# EAGLE schematic Sequencer Block Diagram (EAGLE 9.2.2)

## Sheet 1 of 6
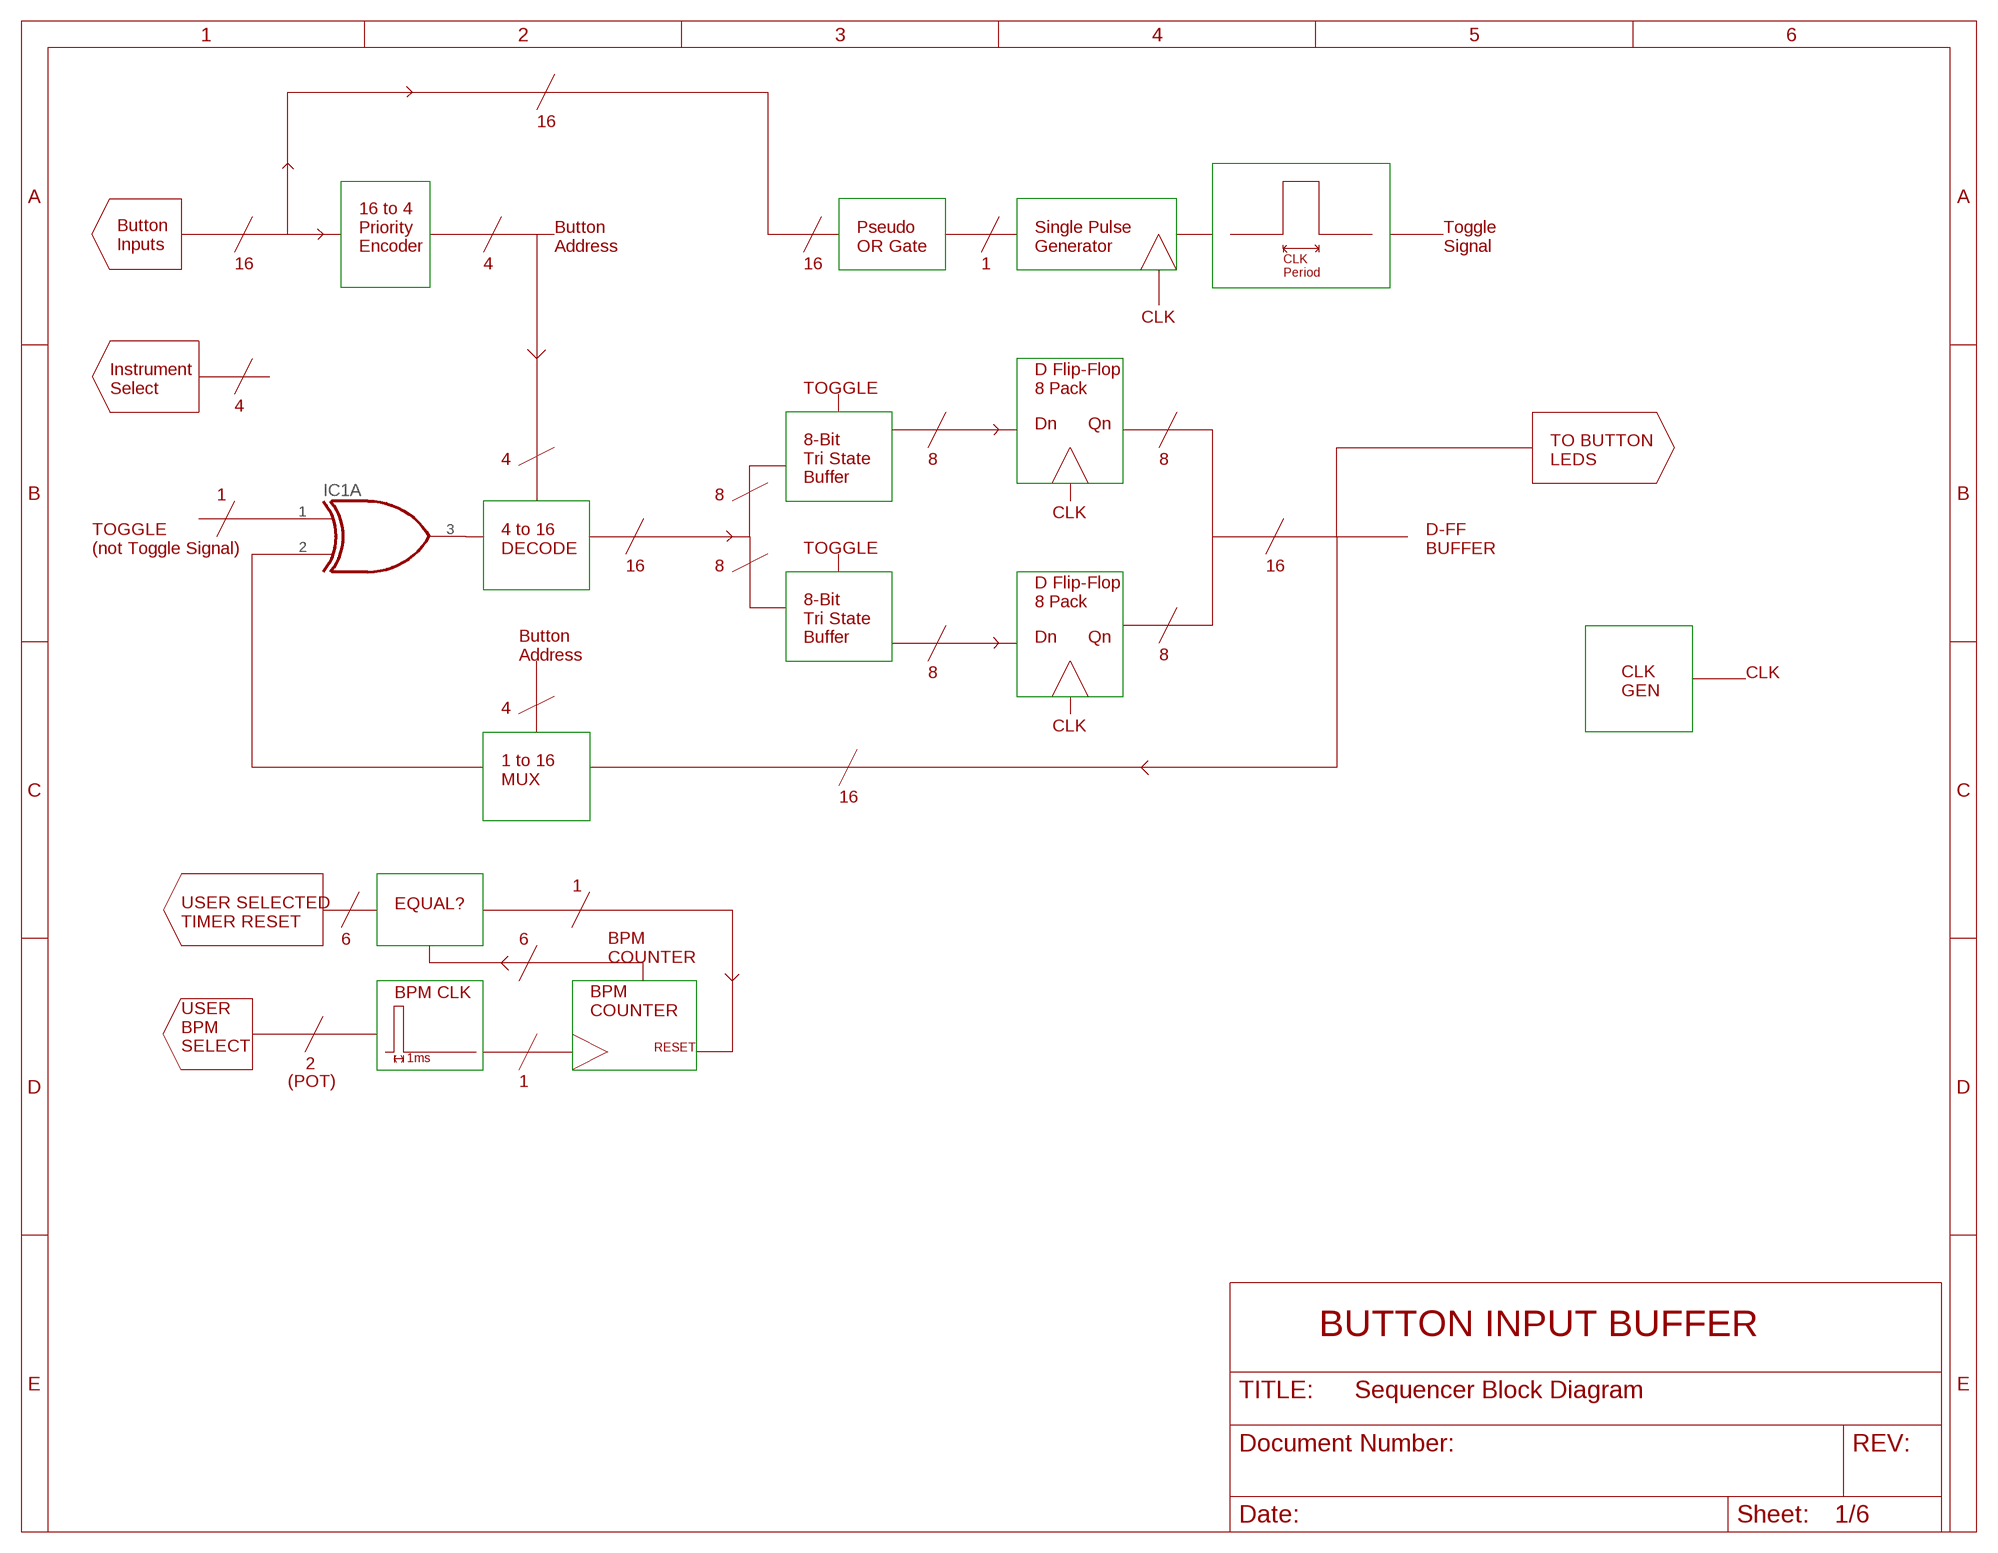
[diagram p0: schematic, sheet 1]

### Parts
IC1  74386N  [DIL14]
Unconnected: IC1.1(A:I0) IC1.2(A:I1) IC1.3(A:O) IC1.4(B:O) IC1.5(B:I0) IC1.6(B:I1) IC1.8(C:I0) IC1.9(C:I1) IC1.10(C:O) IC1.11(D:O) IC1.12(D:I0) IC1.13(D:I1)

### Notes on the sheet
- 16
- Button
  Inputs
- 16 to 4
  Priority
  Encoder
- Button
  Address
- Pseudo
  OR Gate
- Single Pulse
  Generator
- Toggle
  Signal
- 16 | 4 | 16 | 1
- CLK
  Period
- CLK
- Instrument
  Select
- TOGGLE
- D Flip-Flop
  8 Pack
- 4
- Dn | Qn
- 4 | 8 | 8
- TO BUTTON
  LEDS
- 8-Bit
  Tri State
  Buffer
- 1 | 8
- CLK
- TOGGLE
  (not Toggle Signal)
- 4 to 16
  DECODE
- TOGGLE
- D-FF
  BUFFER
- 16 | 8 | 16
- D Flip-Flop
  8 Pack
- 8-Bit
  Tri State
  Buffer
- Dn | Qn
- Button
  Address
- 8
- 8 | CLK
- CLK
  GEN
- 4
- CLK
- 1 to 16
  MUX
- 16
- 1
- EQUAL?
- USER SELECTED
  TIMER RESET
- 6 | 6
- BPM
  COUNTER
- BPM CLK
- BPM
  COUNTER
- USER
  BPM
  SELECT
- RESET
- 1ms
- 2
- (POT) | 1
- BUTTON INPUT BUFFER

## Sheet 2 of 6
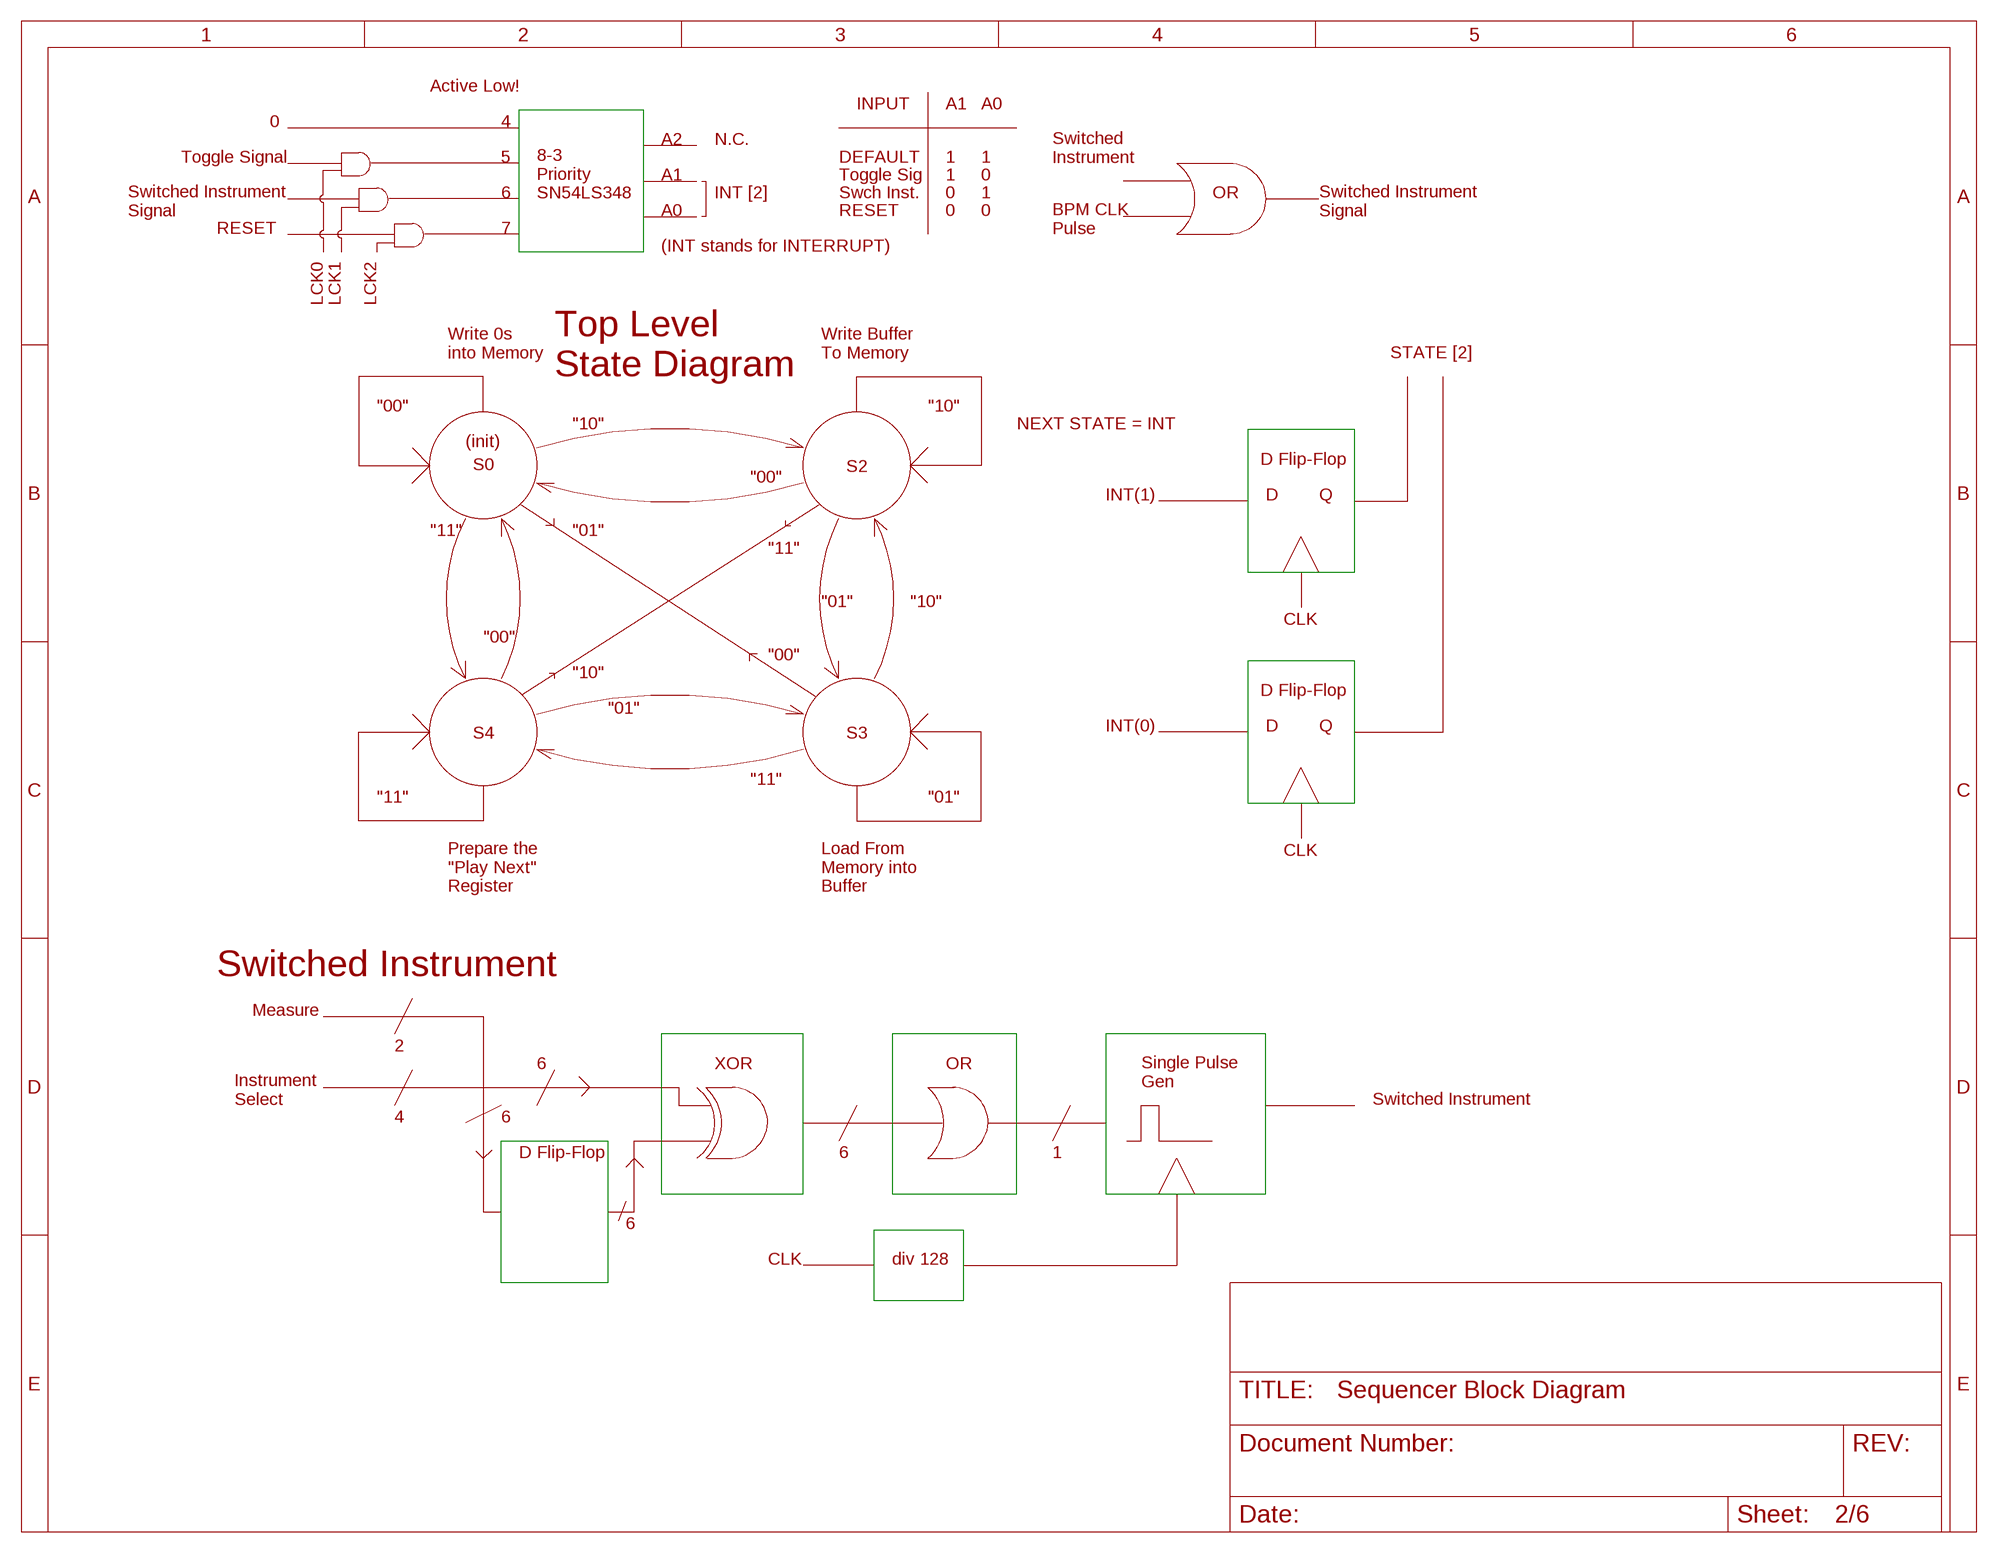
[diagram p1: schematic, sheet 2]

### Notes on the sheet
- Active Low!
- INPUT | A1 | A0
- 0 | 4
- A2 | N.C.
- Toggle Signal | 5 | DEFAULT | 1 | 1
- Switched
  Instrument
- A1 | Toggle Sig | 1 | 0
- 6
- 8-3
  Priority
  SN54LS348
- INT [2] | Swch Inst. | 0 | 1 | OR
- Switched Instrument
  Signal
- A0 | RESET | 0 | 0
- Switched Instrument
  Signal
- RESET | 7
- BPM CLK
  Pulse
- (INT stands for INTERRUPT)
- LCK0 | LCK1 | LCK2
- Write 0s
  into Memory
- Write Buffer
  To Memory
- STATE [2]
- Top Level
  State Diagram
- "00" | "10"
- "10" | NEXT STATE = INT
- (init)
- D Flip-Flop
- S0 | S2
- "00"
- INT(1) | D | Q
- "11" | "01"
- "11"
- "01" | "10"
- CLK
- "00"
- "00"
- "10"
- D Flip-Flop
- "01"
- INT(0) | D | Q
- S4 | S3
- "11"
- "11" | "01"
- CLK
- Prepare the 
  "Play Next"
  Register
- Load From 
  Memory into
  Buffer
- Switched Instrument | Measure
- 2
- 6 | XOR | OR
- Single Pulse
  Gen
- Instrument
  Select
- Switched Instrument
- 4 | 6
- D Flip-Flop | 6 | 1
- 6
- CLK | div 128

## Sheet 3 of 6
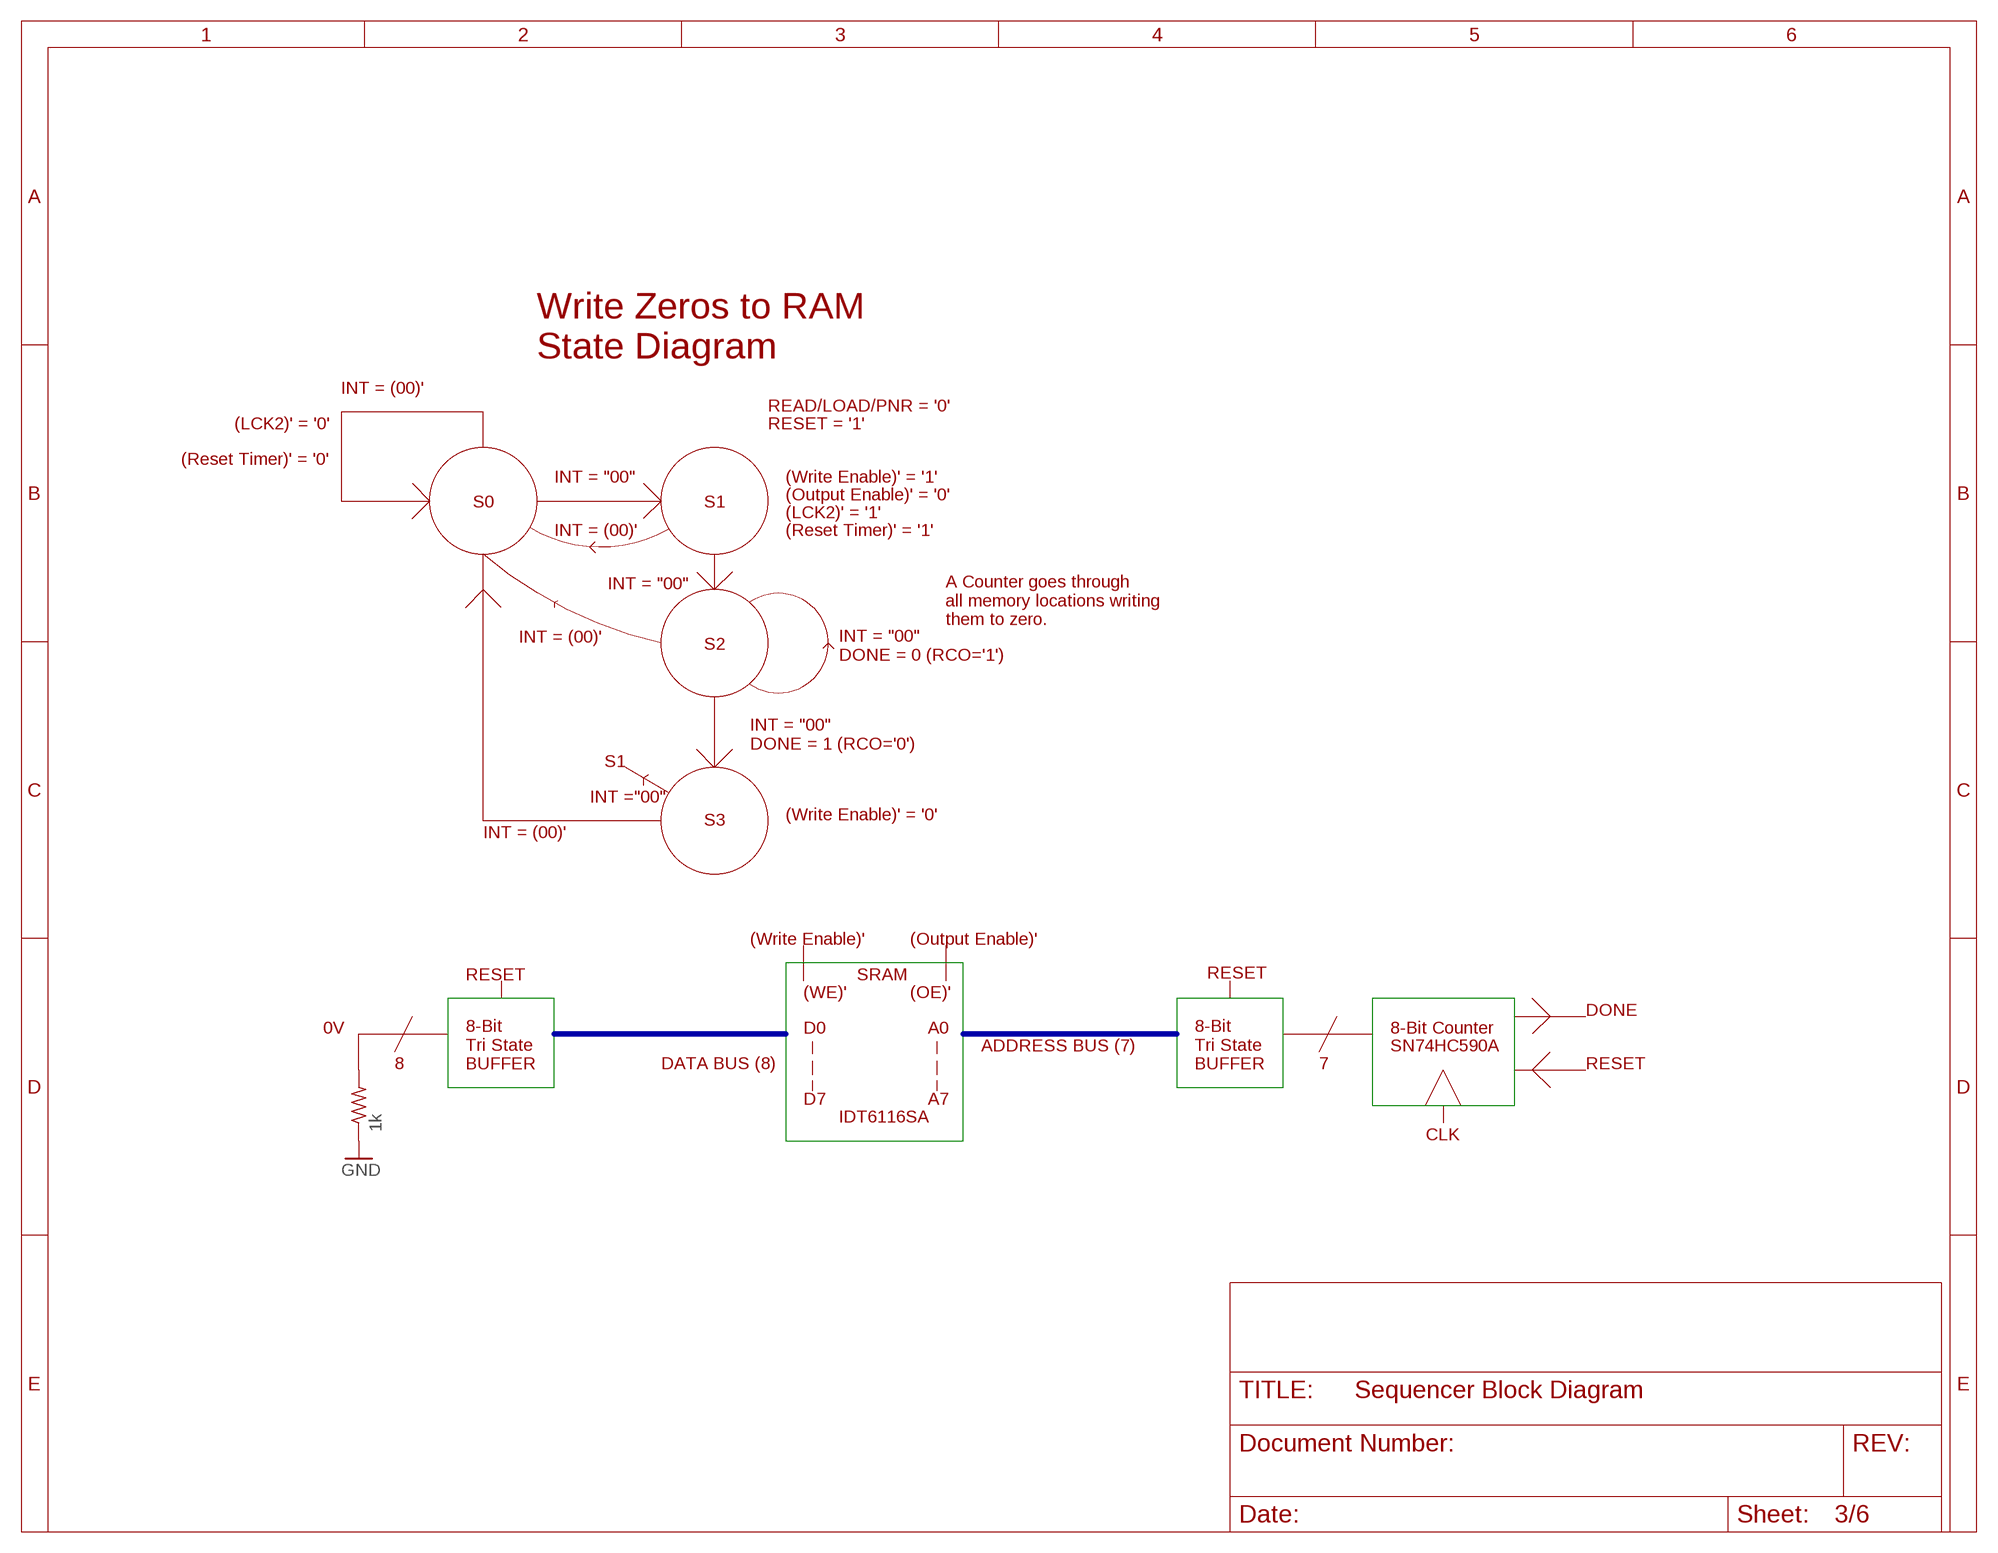
[diagram p2: schematic, sheet 3]

### Parts
R1  1k  R-US_0204/5  [0204/5]

### Nets
GND: R1.1
Unconnected: R1.2

### Buses
N$1,N$2,N$3,N$4,N$5,N$6,N$7,N$8

### Notes on the sheet
- Write Zeros to RAM
  State Diagram
- INT = (00)'
- READ/LOAD/PNR = '0'
- (LCK2)' = '0' | RESET = '1'
- (Reset Timer)' = '0'
- INT = "00" | (Write Enable)' = '1'
- (Output Enable)' = '0'
- S0 | S1
- (LCK2)' = '1'
- INT = (00)' | (Reset Timer)' = '1'
- INT = "00"
- A Counter goes through
  all memory locations writing
  them to zero.
- INT = (00)'
- S2
- INT = "00"
  DONE = 0 (RCO='1')
- INT = "00"
  DONE = 1 (RCO='0')
- S1
- INT ="00"
- (Write Enable)' = '0'
- S3
- INT = (00)'
- (Write Enable)' | (Output Enable)'
- RESET | SRAM | RESET
- (WE)' | (OE)'
- DONE
- 0V | D0 | A0 | 8-Bit Counter
- ADDRESS BUS (7) | SN74HC590A
- 8
- 8-Bit
  Tri State
  BUFFER
- DATA BUS (8)
- 8-Bit
  Tri State
  BUFFER
- 7 | RESET
- D7 | A7
- IDT6116SA
- CLK

## Sheet 4 of 6
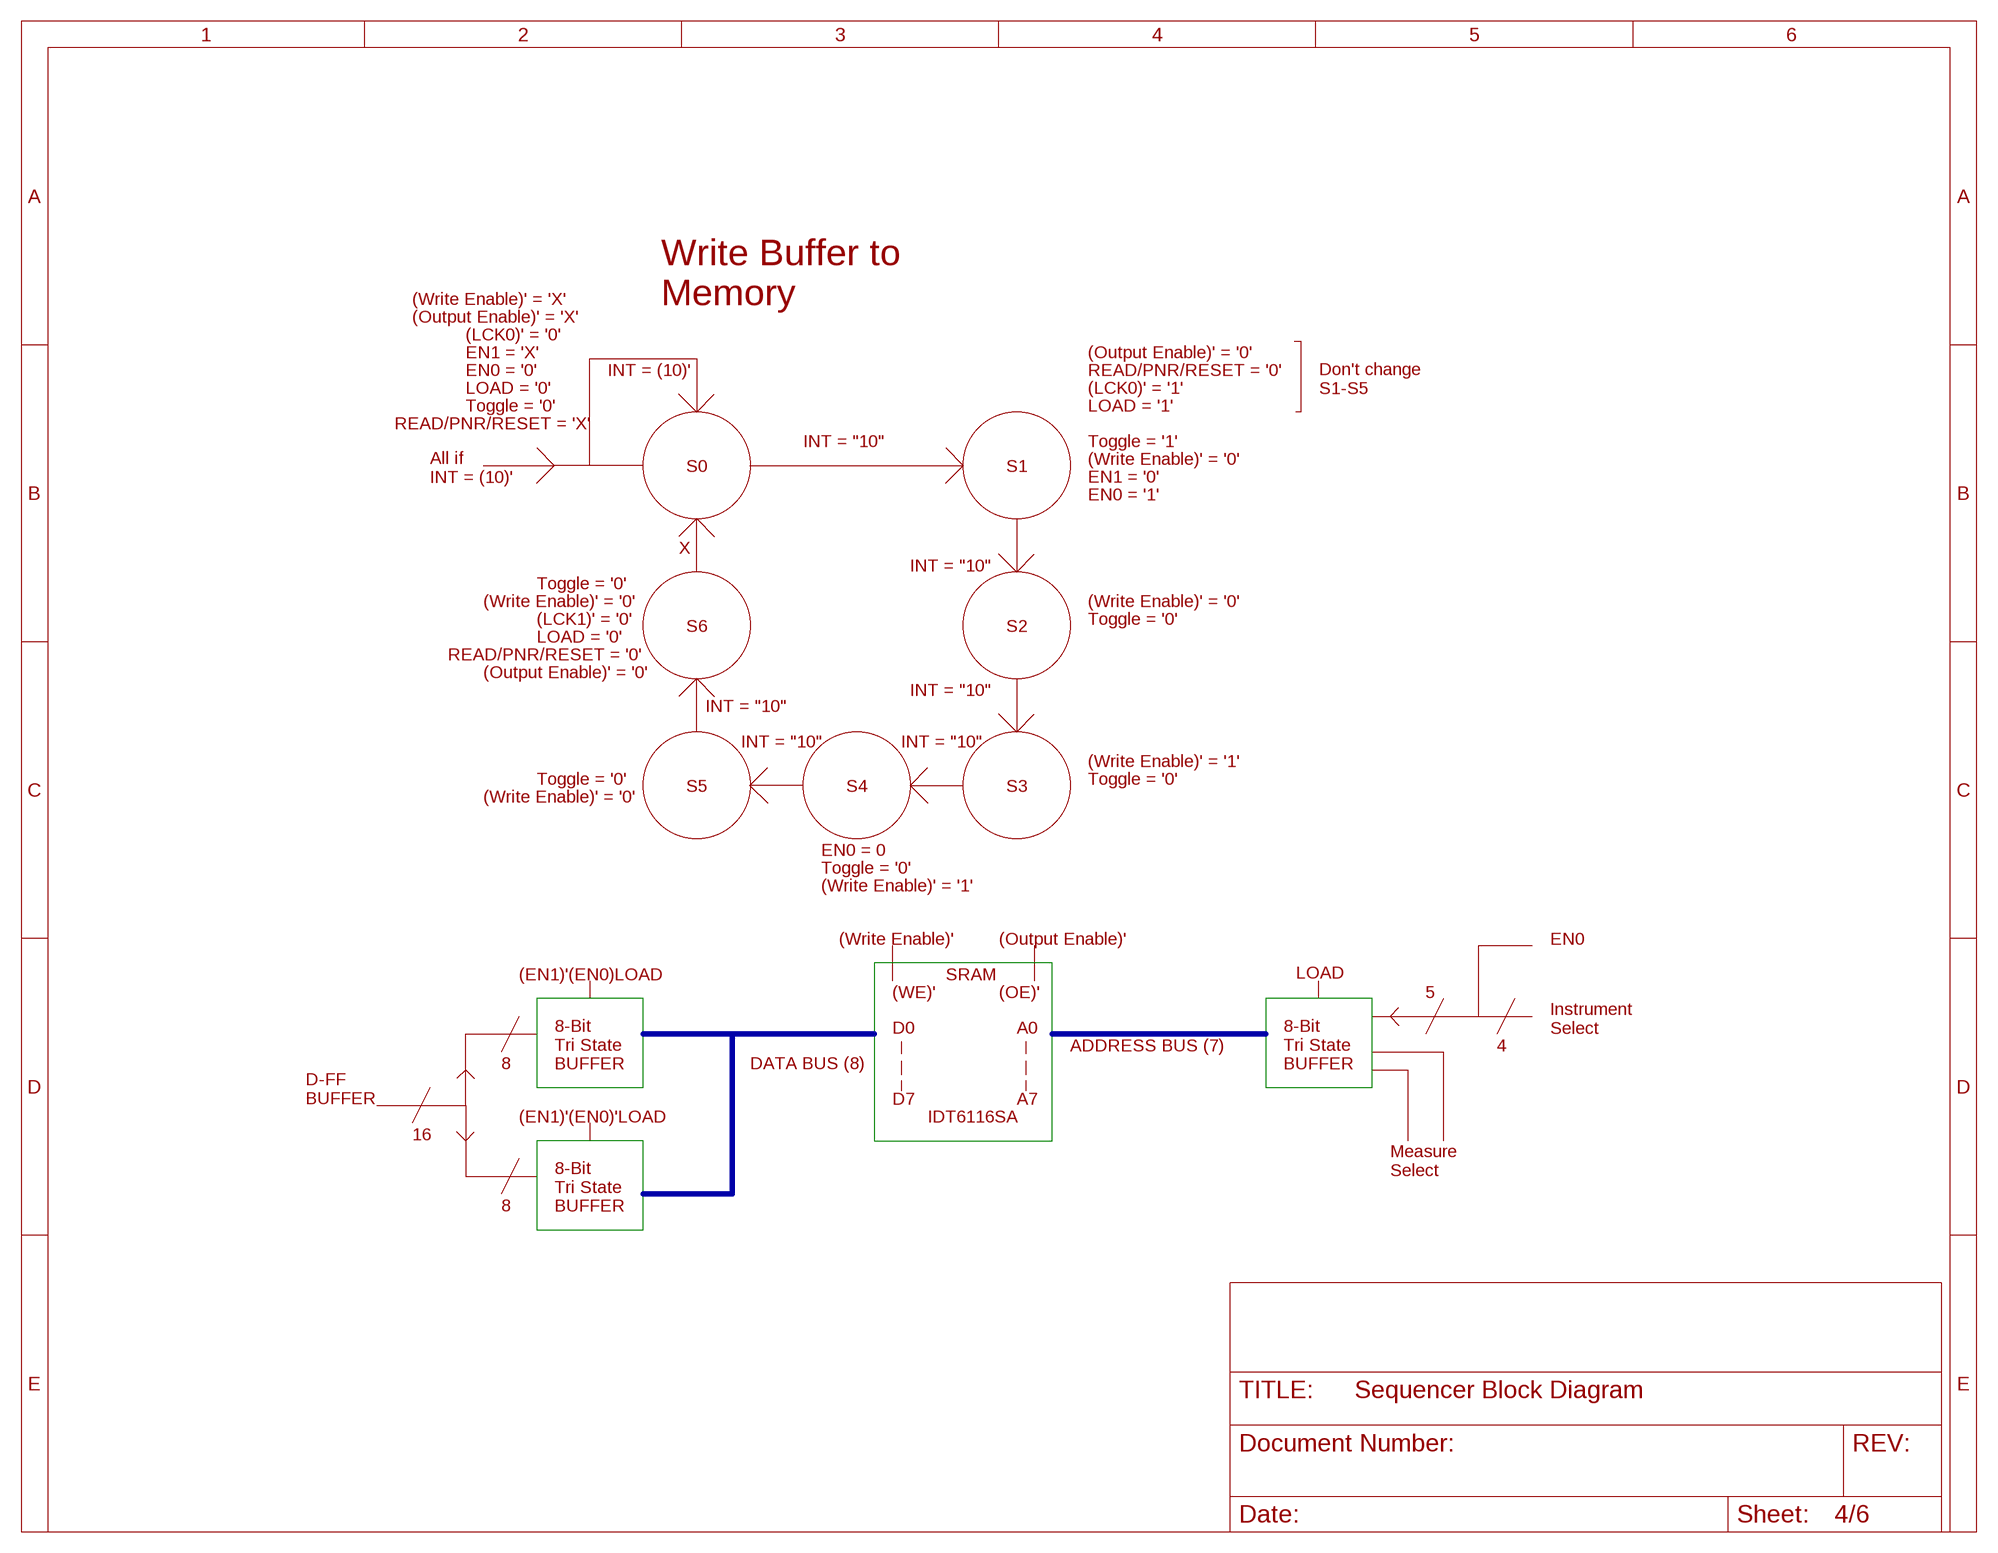
[diagram p3: schematic, sheet 4]

### Buses
N$1,N$2,N$3,N$4,N$5,N$6,N$7,N$8

### Notes on the sheet
- (Write Enable)' = 'X'
- Write Buffer to
  Memory
- (Output Enable)' = 'X'
- (LCK0)' = '0'
- EN1 = 'X' | (Output Enable)' = '0'
- EN0 = '0' | INT = (10)' | READ/PNR/RESET = '0'
- LOAD = '0' | (LCK0)' = '1'
- Don't change
  S1-S5
- Toggle = '0' | LOAD = '1'
- READ/PNR/RESET = 'X'
- INT = "10" | Toggle = '1'
- (Write Enable)' = '0'
- S0 | S1
- All if 
  INT = (10)'
- EN1 = '0'
- EN0 = '1'
- X
- INT = "10"
- Toggle = '0'
- (Write Enable)' = '0' | (Write Enable)' = '0'
- (LCK1)' = '0' | Toggle = '0'
- S6 | S2
- LOAD = '0'
- READ/PNR/RESET = '0'
- (Output Enable)' = '0'
- INT = "10"
- INT = "10"
- INT = "10" | INT = "10"
- (Write Enable)' = '1'
- Toggle = '0' | Toggle = '0'
- S5 | S4 | S3
- (Write Enable)' = '0'
- EN0 = 0
- Toggle = '0'
- (Write Enable)' = '1'
- (Write Enable)' | (Output Enable)' | EN0
- (EN1)'(EN0)LOAD | SRAM | LOAD
- (WE)' | (OE)' | 5
- D0 | A0
- Instrument
  Select
- ADDRESS BUS (7) | 4
- 8
- 8-Bit
  Tri State
  BUFFER
- DATA BUS (8)
- 8-Bit
  Tri State
  BUFFER
- D7 | A7
- D-FF
  BUFFER
- (EN1)'(EN0)'LOAD | IDT6116SA
- 16
- Measure
  Select
- 8
- 8-Bit
  Tri State
  BUFFER

## Sheet 5 of 6
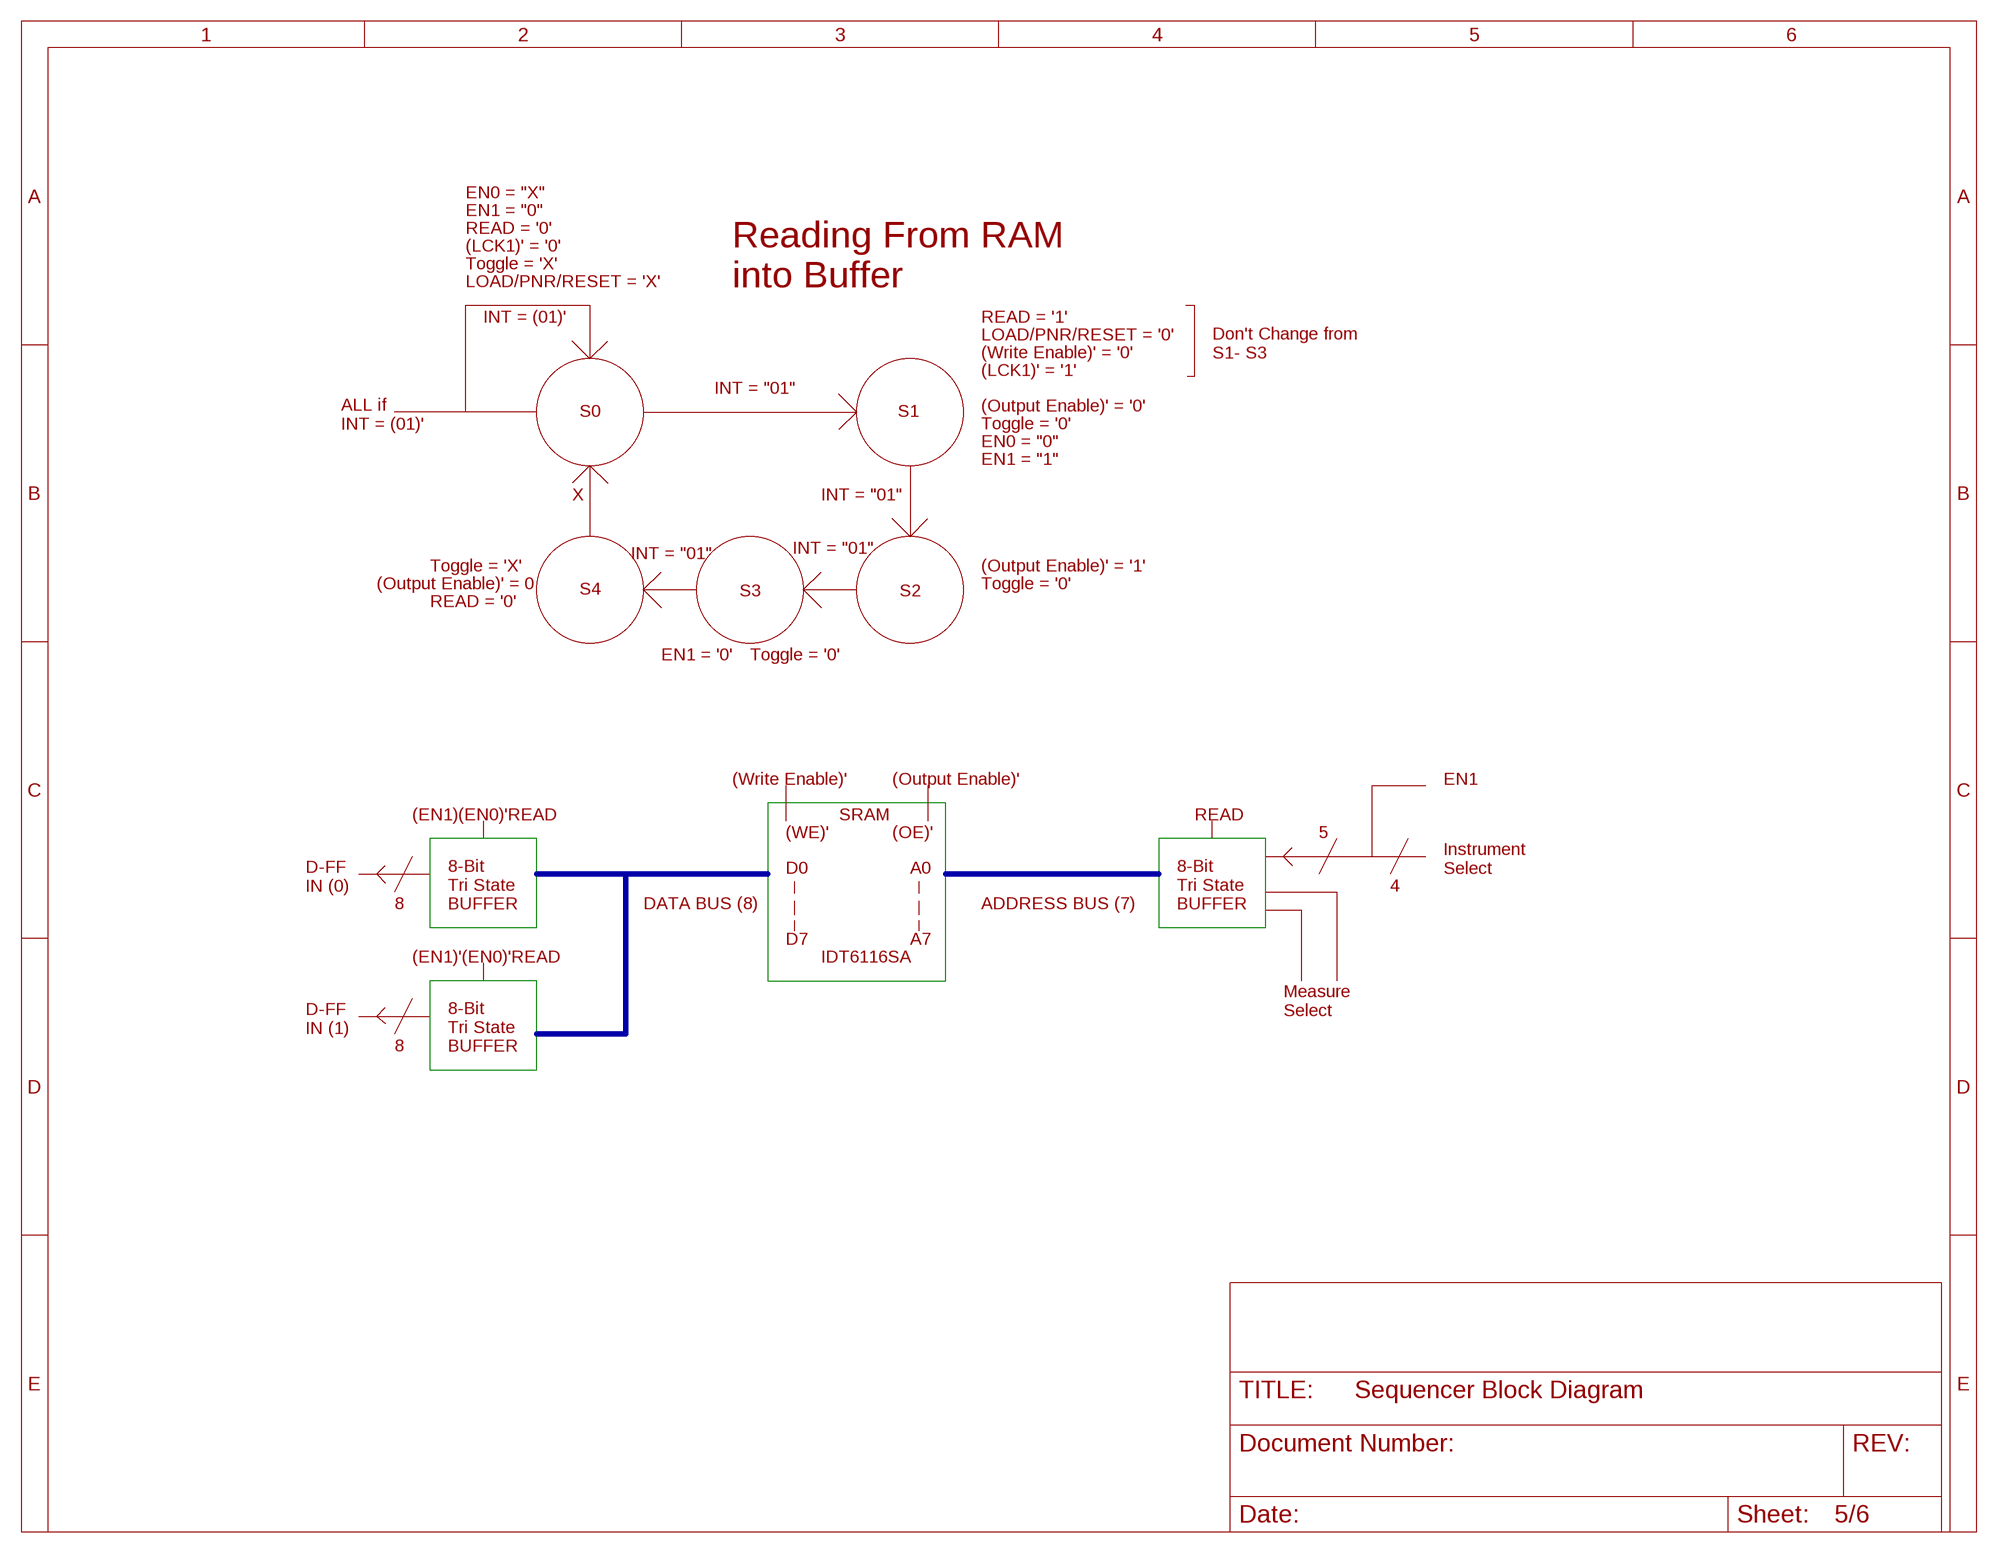
[diagram p4: schematic, sheet 5]

### Buses
N$1,N$2,N$3,N$4,N$5,N$6,N$7,N$8

### Notes on the sheet
- EN0 = "X"
- EN1 = "0"
- READ = '0'
- (LCK1)' = '0'
- Toggle = 'X'
- LOAD/PNR/RESET = 'X'
- Reading From RAM
  into Buffer
- INT = (01)' | READ = '1'
- LOAD/PNR/RESET = '0'
- (Write Enable)' = '0'
- Don't Change from
  S1- S3
- (LCK1)' = '1'
- INT = "01"
- (Output Enable)' = '0'
- S0 | S1
- ALL if
  INT = (01)'
- Toggle = '0'
- EN0 = "0"
- EN1 = "1"
- X | INT = "01"
- INT = "01"
- INT = "01"
- Toggle = 'X' | (Output Enable)' = '1'
- (Output Enable)' = 0 | Toggle = '0'
- S4 | S3 | S2
- READ = '0'
- EN1 = '0' | Toggle = '0'
- (Write Enable)' | (Output Enable)' | EN1
- (EN1)(EN0)'READ | SRAM | READ
- (WE)' | (OE)' | 5
- D0 | A0
- Instrument
  Select
- D-FF
  IN (0)
- 4
- 8
- 8-Bit
  Tri State
  BUFFER
- DATA BUS (8) | ADDRESS BUS (7)
- 8-Bit
  Tri State
  BUFFER
- D7 | A7
- (EN1)'(EN0)'READ | IDT6116SA
- Measure
  Select
- D-FF
  IN (1)
- 8
- 8-Bit
  Tri State
  BUFFER

## Sheet 6 of 6
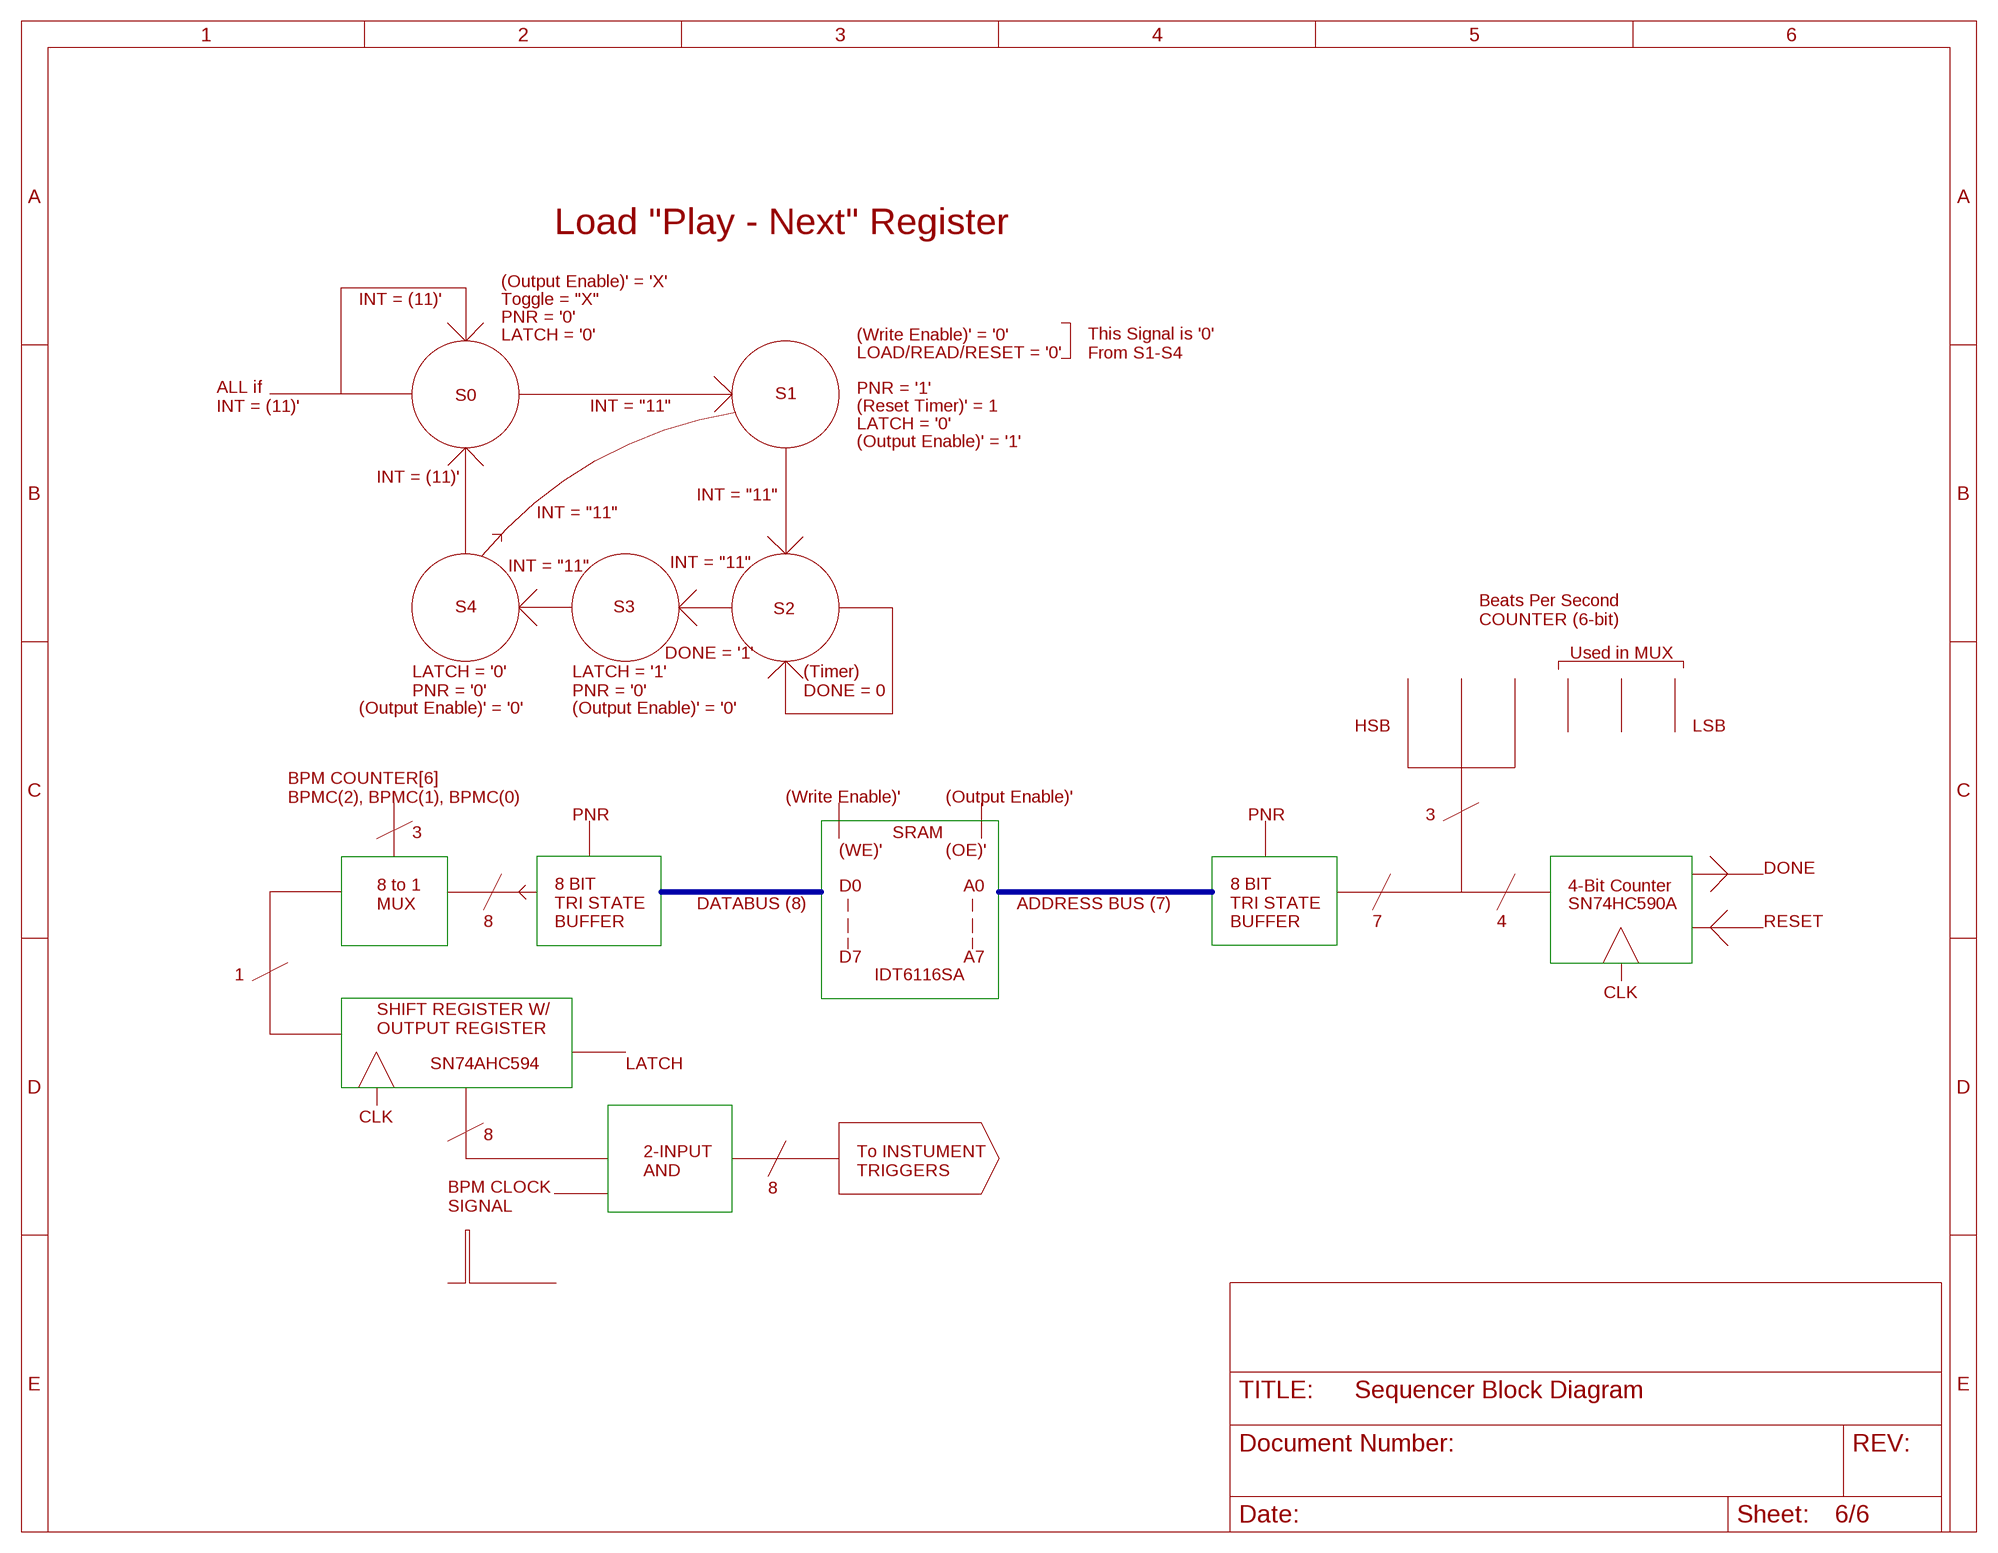
[diagram p5: schematic, sheet 6]

### Buses
N$1,N$2,N$3,N$4,N$5,N$6,N$7,N$8

### Notes on the sheet
- Load "Play - Next" Register
- (Output Enable)' = 'X'
- INT = (11)' | Toggle = "X"
- PNR = '0'
- LATCH = '0' | (Write Enable)' = '0'
- LOAD/READ/RESET = '0'
- This Signal is '0'
  From S1-S4
- PNR = '1'
- S0 | S1
- ALL if 
  INT = (11)'
- INT = "11" | (Reset Timer)' = 1
- LATCH = '0'
- (Output Enable)' = '1'
- INT = (11)'
- INT = "11"
- INT = "11"
- INT = "11" | INT = "11"
- S4 | S3 | S2
- Beats Per Second
  COUNTER (6-bit)
- DONE = '1' | Used in MUX
- LATCH = '0'
  PNR = '0'
- LATCH = '1'
  PNR = '0'
- (Timer)
  DONE = 0
- (Output Enable)' = '0' | (Output Enable)' = '0'
- HSB | LSB
- BPM COUNTER[6]
  BPMC(2), BPMC(1), BPMC(0)
- (Write Enable)' | (Output Enable)'
- PNR | PNR | 3
- 3 | SRAM
- (WE)' | (OE)'
- DONE
- D0 | A0 | 4-Bit Counter
- 8 to 1
  MUX
- DATABUS (8) | ADDRESS BUS (7) | SN74HC590A
- 8
- 8 BIT
  TRI STATE
  BUFFER
- 8 BIT
  TRI STATE
  BUFFER
- 7 | 4 | RESET
- D7 | A7
- 1 | IDT6116SA
- CLK
- SHIFT REGISTER W/
  OUTPUT REGISTER
- SN74AHC594 | LATCH
- CLK
- 8
- 2-INPUT
  AND
- To INSTUMENT
  TRIGGERS
- 8
- BPM CLOCK
  SIGNAL

## Power pins joined to a net without a drawn wire
GND: IC1.7(P:GND)
VCC: IC1.14(P:VCC)

## Library data of the parts
IC1 = 74xx-us:74*386: Quadruple 2-input EXCLUSIVE-OR (XOR) gate
R1 = rcl:R-US_: RESISTOR, American symbol; SPICEPREFIX: R